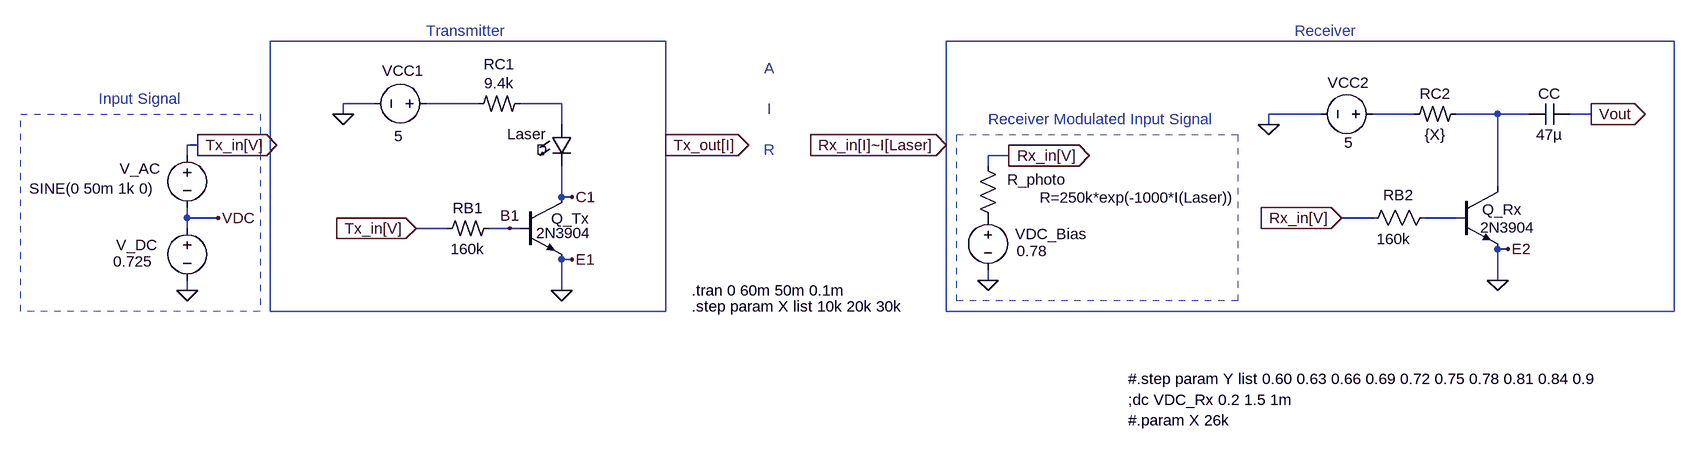
[diagram p0: schematic elec310_proj_Tx_Rx.asc]
elec310_proj_Tx_Rx.asc, the LTspice schematic file:
Version 4
SHEET 1 1400 680
WIRE -960 112 -1008 112
WIRE -800 112 -880 112
WIRE -672 112 -736 112
WIRE -1008 128 -1008 112
WIRE 496 128 416 128
WIRE 640 128 576 128
WIRE 768 128 704 128
WIRE 816 128 768 128
WIRE 912 128 880 128
WIRE -672 144 -672 112
WIRE 416 144 416 128
WIRE -1232 176 -1248 176
WIRE -1248 192 -1248 176
WIRE 16 192 -16 192
WIRE -16 208 -16 192
WIRE 768 240 768 128
WIRE -672 256 -672 208
WIRE -656 256 -672 256
WIRE -1248 288 -1248 272
WIRE -1200 288 -1248 288
WIRE 576 288 528 288
WIRE 704 288 656 288
WIRE -1248 304 -1248 288
WIRE -848 304 -896 304
WIRE -752 304 -784 304
WIRE -736 304 -752 304
WIRE 784 336 768 336
WIRE -656 352 -672 352
WIRE -16 384 -16 368
WIRE 768 384 768 336
WIRE -1248 400 -1248 384
WIRE -672 400 -672 352
FLAG -1200 288 VDC
FLAG -656 256 C1
FLAG -752 304 B1
FLAG 912 128 Vout
IOPIN 912 128 Out
FLAG -1232 176 Tx_in[V]
IOPIN -1232 176 Out
FLAG -1248 400 0
FLAG -672 400 0
FLAG -896 304 Tx_in[V]
IOPIN -896 304 In
FLAG -656 352 E1
FLAG -1008 128 0
FLAG -512 176 Tx_out[I]
IOPIN -512 176 Out
FLAG -80 176 Rx_in[I]~I[Laser]
IOPIN -80 176 In
FLAG 16 192 Rx_in[V]
IOPIN 16 192 Out
FLAG -16 384 0
FLAG 528 288 Rx_in[V]
IOPIN 528 288 In
FLAG 768 384 0
FLAG 784 336 E2
FLAG 416 144 0
SYMBOL npn -736 256 R0
WINDOW 0 48 33 Left 2
WINDOW 3 25 55 Left 2
SYMATTR InstName Q_Tx
SYMATTR Value 2N3904
SYMBOL voltage -864 112 R90
WINDOW 123 0 0 Left 0
WINDOW 39 0 0 Left 0
WINDOW 0 -51 20 VRight 2
WINDOW 3 50 52 VRight 2
SYMATTR InstName VCC1
SYMATTR Value 5
SYMBOL LED -688 144 R0
WINDOW 0 -68 15 Left 2
WINDOW 3 -23 39 Left 2
SYMATTR InstName Laser
SYMBOL voltage -1248 288 R0
WINDOW 0 -109 42 Left 2
WINDOW 3 -114 67 Left 2
WINDOW 123 0 0 Left 0
WINDOW 39 0 0 Left 0
SYMATTR InstName V_DC
SYMATTR Value 0.725
SYMBOL voltage -1248 176 R0
WINDOW 123 0 0 Left 0
WINDOW 39 0 0 Left 0
WINDOW 0 -104 36 Left 2
WINDOW 3 -243 67 Left 2
SYMATTR InstName V_AC
SYMATTR Value SINE(0 50m 1k 0)
SYMBOL npn 704 240 R0
WINDOW 0 40 35 Left 2
WINDOW 3 37 63 Left 2
SYMATTR InstName Q_Rx
SYMATTR Value 2N3904
SYMBOL res 560 304 R270
WINDOW 0 36 55 VTop 2
WINDOW 3 -1 48 VBottom 2
SYMATTR InstName RB2
SYMATTR Value 160k
SYMBOL voltage 592 128 R90
WINDOW 123 0 0 Left 0
WINDOW 39 0 0 Left 0
WINDOW 0 -48 85 VLeft 2
WINDOW 3 44 60 VLeft 2
SYMATTR InstName VCC2
SYMATTR Value 5
SYMBOL res 0 304 R180
WINDOW 0 -105 75 Left 2
WINDOW 3 -367 47 Left 2
SYMATTR InstName R_photo
SYMATTR Value R=250k*exp(-1000*I(Laser))
SYMBOL voltage -16 272 R0
WINDOW 0 42 41 Left 2
WINDOW 3 44 67 Left 2
WINDOW 123 0 0 Left 0
WINDOW 39 0 0 Left 0
SYMATTR InstName VDC_Bias
SYMATTR Value 0.78
SYMBOL cap 880 112 R90
WINDOW 0 0 32 VBottom 2
WINDOW 3 32 32 VTop 2
SYMATTR InstName CC
SYMATTR Value 47µ
SYMBOL res2 -784 288 R90
WINDOW 0 0 32 VBottom 2
WINDOW 3 32 32 VTop 2
SYMATTR InstName RB1
SYMATTR Value 160k
SYMBOL res2 -736 96 R90
WINDOW 0 -29 32 VBottom 2
WINDOW 3 -31 32 VTop 2
SYMATTR InstName RC1
SYMATTR Value 9.4k
SYMBOL res2 704 112 R90
WINDOW 0 0 32 VBottom 2
WINDOW 3 32 32 VTop 2
SYMATTR InstName RC2
SYMATTR Value {X}
TEXT -472 400 Left 2 !.tran 0 60m 50m 0.1m
TEXT -472 424 Left 2 !.step param X list 10k 20k 30k
TEXT 200 568 Left 2 !;dc VDC_Rx 0.2 1.5 1m
TEXT 200 600 Left 2 !#.param X 26k
TEXT 200 536 Left 2 !#.step param Y list 0.60 0.63 0.66 0.69 0.72 0.75 0.78 0.81 0.84 0.9
TEXT -1384 104 Left 2 ;Input Signal
TEXT -880 0 Left 2 ;Transmitter
TEXT -352 120 Center 2 ;A\n \nI\n \nR
TEXT -16 136 Left 2 ;Receiver Modulated Input Signal
TEXT 456 0 Left 2 ;Receiver
RECTANGLE Normal -1136 432 -1504 128 1
RECTANGLE Normal -512 432 -1120 16
RECTANGLE Normal 368 416 -64 160 1
RECTANGLE Normal 1040 432 -80 16

The netlist it stands for:
* elec310_proj_Tx_Rx.asc
Q_Tx C1 B1 0 0 2N3904
VCC1 N001 0 5
D§Laser N002 C1 D
V_DC VDC 0 0.725
V_AC Tx_in[V] VDC SINE(0 50m 1k 0)
Q_Rx N004 N005 0 0 2N3904
RB2 Rx_in[V] N005 160k
VCC2 N003 0 5
R_photo P001 Rx_in[V] R=250k*exp(-1000*I(Laser))
VDC_Bias P001 0 0.78
CC Vout N004 47µ
RB1 B1 Tx_in[V] 160k
RC1 N002 N001 9.4k
RC2 N004 N003 {X}
.model D D
.lib standard.dio
.model NPN NPN
.model PNP PNP
.lib standard.bjt
.tran 0 60m 50m 0.1m
.step param X list 10k 20k 30k
;dc VDC_Rx 0.2 1.5 1m
#.param X 26k
#.step param Y list 0.60 0.63 0.66 0.69 0.72 0.75 0.78 0.81 0.84 0.9
* Input Signal
* Transmitter
* A
* I
* R
* Receiver Modulated Input Signal
* Receiver
.backanno
.end